# Altium schematic sheet H-BRIDGE.SchDoc
size D; SheetNumber: 2; SheetTotal: 2; PageSetup: Record=PageOptions|CenterHorizontal=True|CenterVertical=True|PrintScale=0.72|XCorrection=1.00|YCorrection=1.00|PrintKind=0|BorderSize=5000000|LeftOffset=0|BottomOffset=0|Orientation=2|PaperLength=1000|PaperWidth=1000|Scale=100|PaperSource=7|PrintQuality=-4|MediaType=1|DitherType=10|PaperKind=Letter (8 1/2 x 11 in)|PrintScaleMode=1
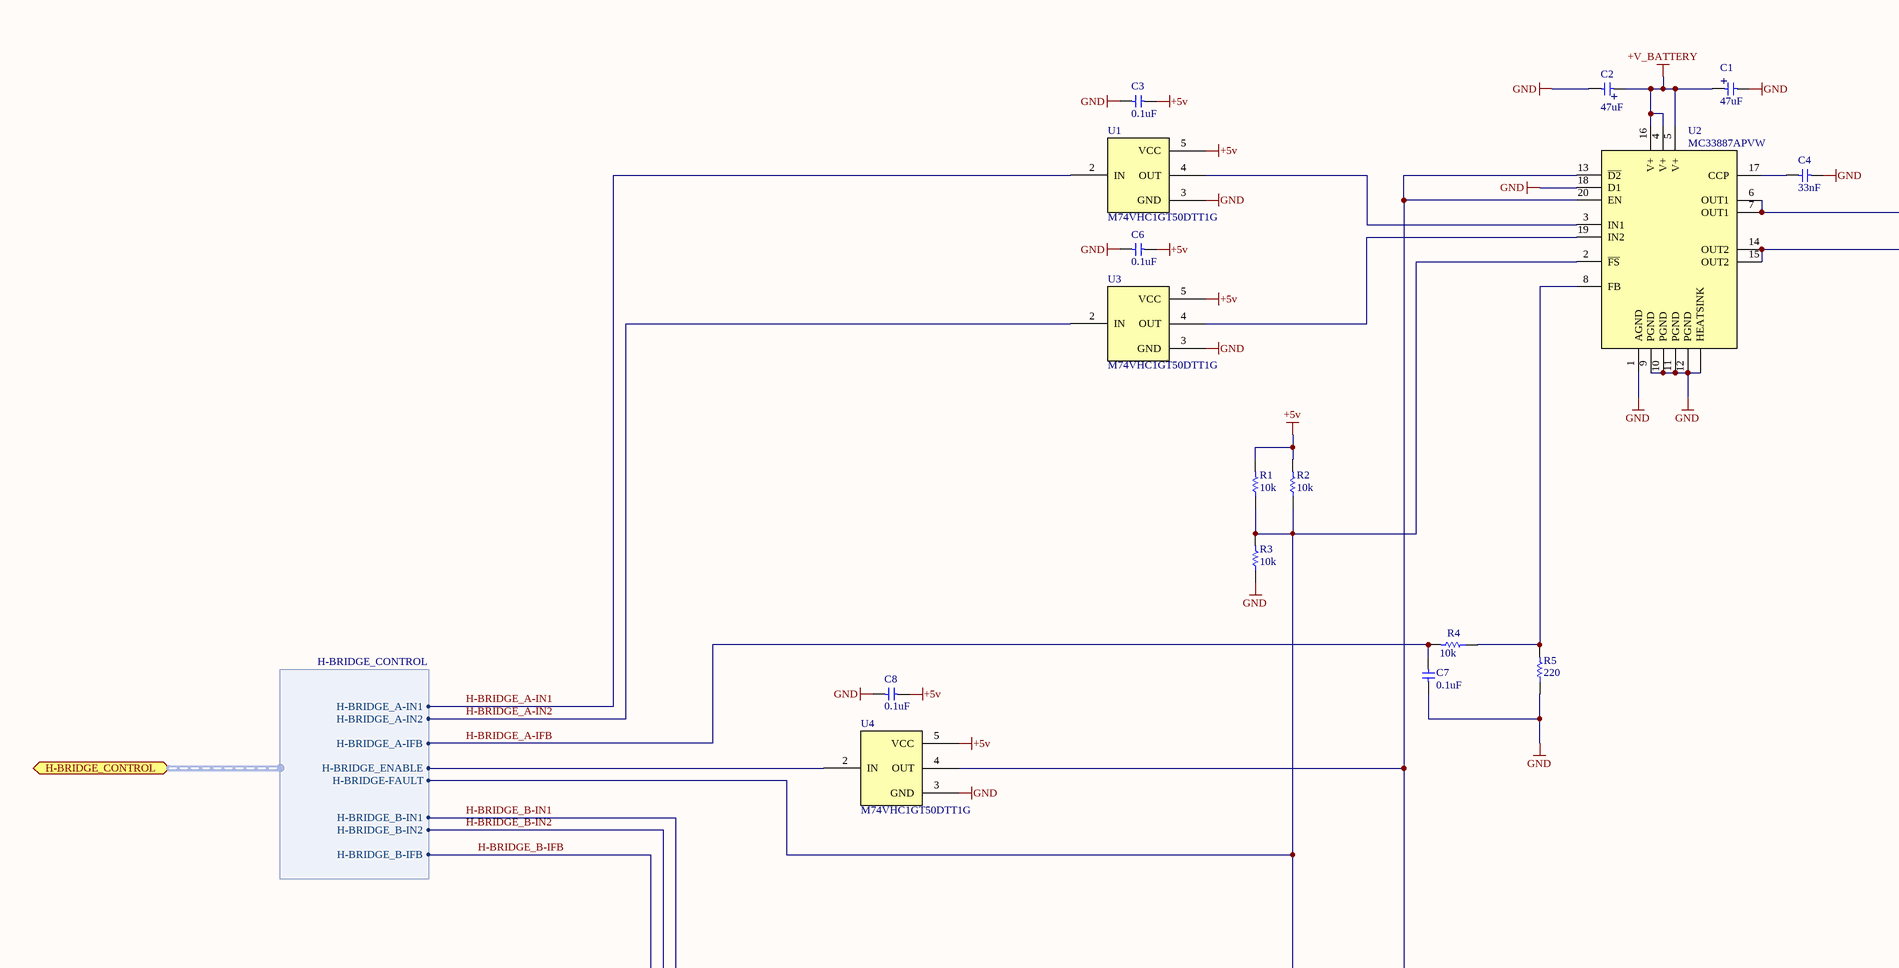
[diagram p0: H-BRIDGE.SchDoc, top left]
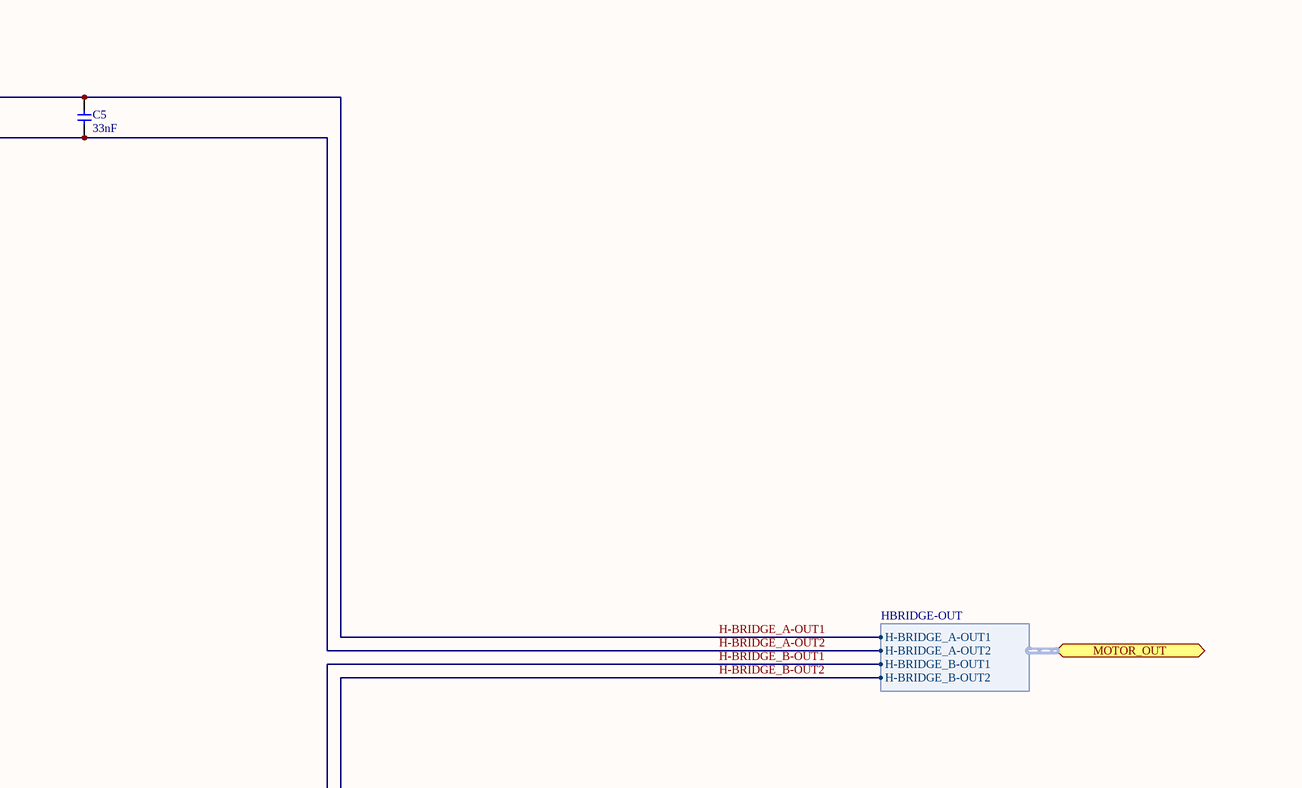
[diagram p1: H-BRIDGE.SchDoc, top right]
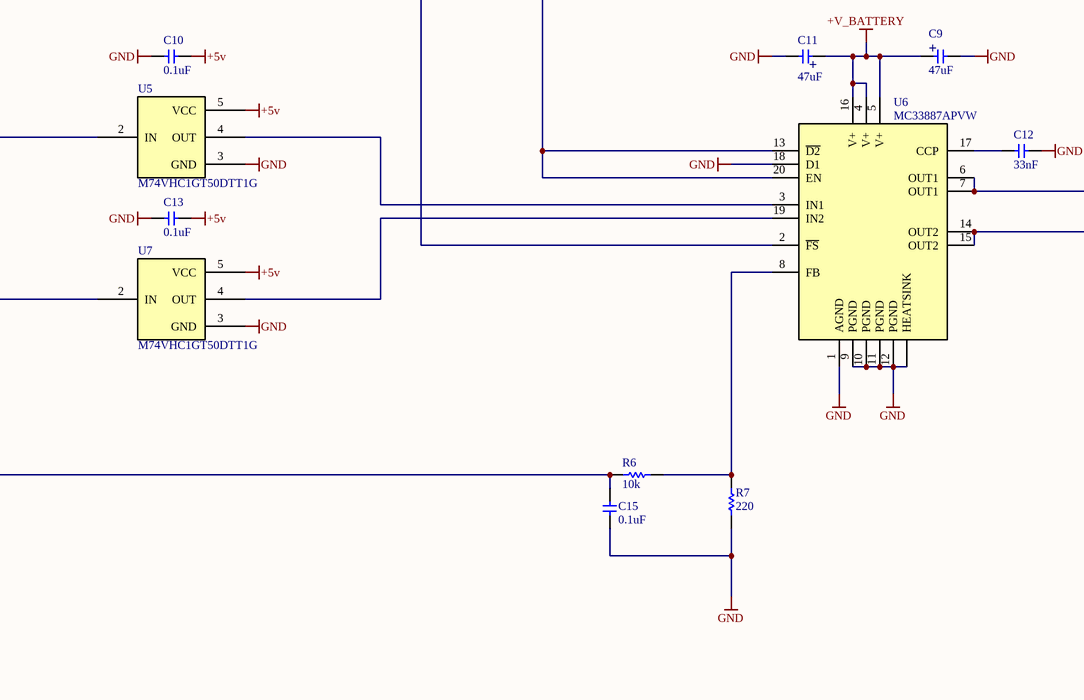
[diagram p2: H-BRIDGE.SchDoc, bottom left]
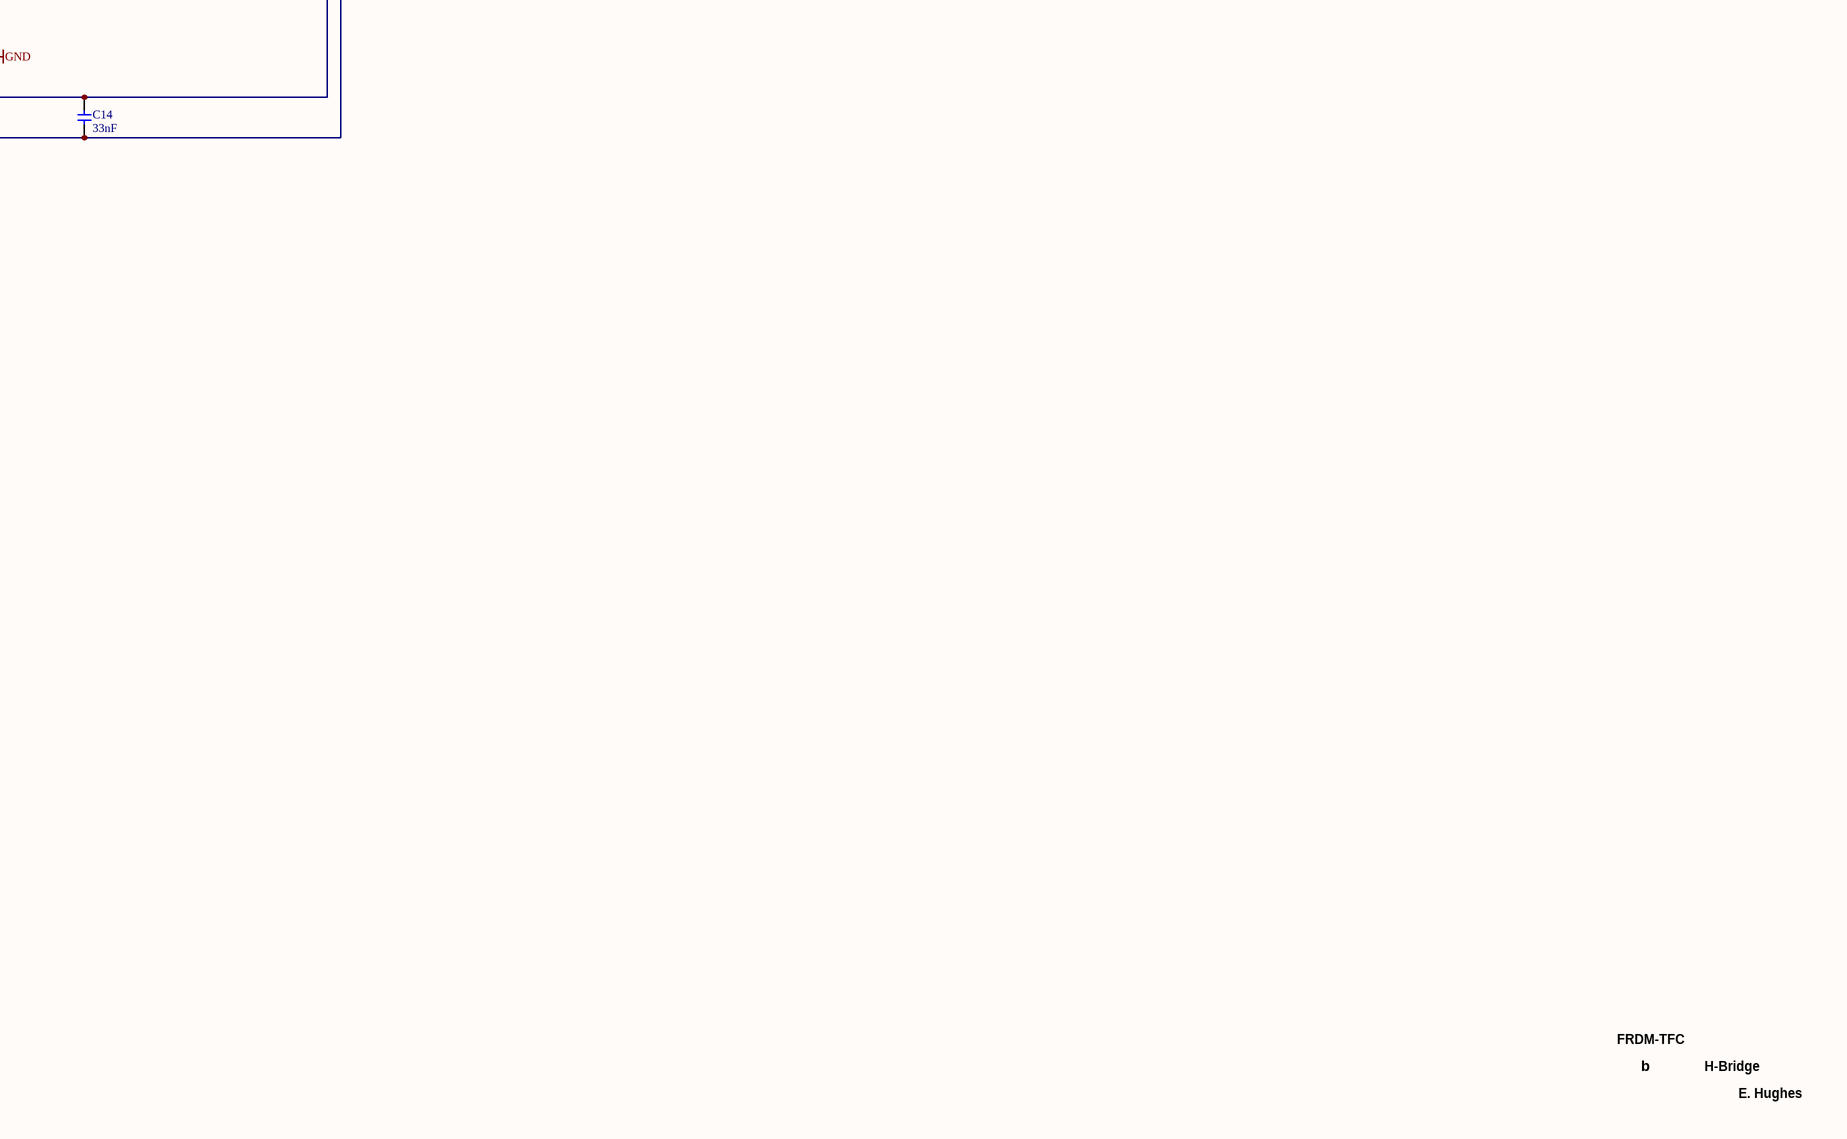
[diagram p3: H-BRIDGE.SchDoc, bottom right]

## Parts
C1  47uF  [PANASONIC_D]
C2  47uF  [PANASONIC_D]
C3  0.1uF  [C0603]
C4  33nF  [C0603]
C5  33nF  [C0603]
C6  0.1uF  [C0603]
C7  0.1uF  [C0603]
C8  0.1uF  [C0603]
C9  47uF  [PANASONIC_D]
C10  0.1uF  [C0603]
C11  47uF  [PANASONIC_D]
C12  33nF  [C0603]
C13  0.1uF  [C0603]
C14  33nF  [C0603]
C15  0.1uF  [C0603]
R1  10k  [R0603]
R2  10k  [R0603]
R3  10k  [R0603]
R4  10k  [R0603]
R5  220  [R0603]
R6  10k  [R0603]
R7  220  [R0603]
U1  M74VHC1GT50DTT1G  [SOT95P245X145-5L]
U2  MC33887APVW  [FREESCALE HSOP-20]
U3  M74VHC1GT50DTT1G  [SOT95P245X145-5L]
U4  M74VHC1GT50DTT1G  [SOT95P245X145-5L]
U5  M74VHC1GT50DTT1G  [SOT95P245X145-5L]
U6  MC33887APVW  [FREESCALE HSOP-20]
U7  M74VHC1GT50DTT1G  [SOT95P245X145-5L]

## Ports
H-BRIDGE_CONTROL (harness H-BRIDGE_CONTROL), MOTOR_OUT (harness HBRIDGE-OUT)

## Harnesses
H-BRIDGE_CONTROL: H-BRIDGE_A-IN2, H-BRIDGE_A-IN1, H-BRIDGE_ENABLE, H-BRIDGE-FAULT, H-BRIDGE_A-IFB, H-BRIDGE_B-IN2, H-BRIDGE_B-IN1, H-BRIDGE_B-IFB
HBRIDGE-OUT: H-BRIDGE_A-OUT1, H-BRIDGE_A-OUT2, H-BRIDGE_B-OUT1, H-BRIDGE_B-OUT2

## Nets
+5v: C3.2 C6.2 C8.2 C10.2 C13.2 R1.2 R2.2 U1.5(VCC) U3.5(VCC) U4.5(VCC) U5.5(VCC) U7.5(VCC)
+V_BATTERY: C1.1 C2.1 C9.1 C11.1 U2.4(V+) U2.5(V+) U2.16(V+) U6.4(V+) U6.5(V+) U6.16(V+)
GND: C1.2 C2.2 C3.1 C4.2 C6.1 C7.2 C8.1 C9.2 C10.1 C11.2 C12.2 C13.1 C15.2 R3.1 R5.1 R7.1 U1.3(GND) U2.1(AGND) U2.9(PGND) U2.10(PGND) U2.11(PGND) U2.12(PGND) U2.18(D1) U2.HEATSINK U3.3(GND) U4.3(GND) U5.3(GND) U6.1(AGND) U6.9(PGND) U6.10(PGND) U6.11(PGND) U6.12(PGND) U6.18(D1) U6.HEATSINK U7.3(GND)
H-BRIDGE_A-IFB: C7.1 R4.2 ; port H-BRIDGE_CONTROL.H-BRIDGE_A-IFB
H-BRIDGE_A-IN1: U1.2(IN) ; port H-BRIDGE_CONTROL.H-BRIDGE_A-IN1
H-BRIDGE_A-IN2: U3.2(IN) ; port H-BRIDGE_CONTROL.H-BRIDGE_A-IN2
H-BRIDGE_A-OUT1: C5.2 U2.6(OUT1) U2.7(OUT1) ; port MOTOR_OUT.H-BRIDGE_A-OUT1
H-BRIDGE_A-OUT2: C5.1 U2.14(OUT2) U2.15(OUT2) ; port MOTOR_OUT.H-BRIDGE_A-OUT2
H-BRIDGE_B-IFB: C15.1 R6.2 ; port H-BRIDGE_CONTROL.H-BRIDGE_B-IFB
H-BRIDGE_B-IN1: U5.2(IN) ; port H-BRIDGE_CONTROL.H-BRIDGE_B-IN1
H-BRIDGE_B-IN2: U7.2(IN) ; port H-BRIDGE_CONTROL.H-BRIDGE_B-IN2
H-BRIDGE_B-OUT1: C14.2 U6.6(OUT1) U6.7(OUT1) ; port MOTOR_OUT.H-BRIDGE_B-OUT1
H-BRIDGE_B-OUT2: C14.1 U6.14(OUT2) U6.15(OUT2) ; port MOTOR_OUT.H-BRIDGE_B-OUT2
NetC4_1: C4.1 U2.17(CCP)
NetC12_1: C12.1 U6.17(CCP)
NetR1_1: R1.1 R2.1 R3.2 U2.2(~{FS}) U6.2(~{FS}) ; port H-BRIDGE_CONTROL.H-BRIDGE-FAULT
NetR4_1: R4.1 R5.2 U2.8(FB)
NetR6_1: R6.1 R7.2 U6.8(FB)
NetU1_4: U1.4(OUT) U2.3(IN1)
NetU2_13: U2.13(~{D2}) U2.20(EN) U4.4(OUT) U6.13(~{D2}) U6.20(EN)
NetU2_19: U2.19(IN2) U3.4(OUT)
NetU4_2: U4.2(IN) ; port H-BRIDGE_CONTROL.H-BRIDGE_ENABLE
NetU5_4: U5.4(OUT) U6.3(IN1)
NetU6_19: U6.19(IN2) U7.4(OUT)

## Notes on the sheet
- FRDM-TFC
- b
- H-Bridge
- E. Hughes
- -1
- 2
- Wavenumber
- Technologies
- pl
- Rev:
- Sheet
- of
- (in symbol EEE-1EA470WP) +

## Library data of the parts
C1 C2 C9 C11 = EEE-1EA470WP: CAP ELECT 47UF 25V VS SMD; Manufacturer: Panasonic - ECG; Capacitance: 47µF; Tolerance: ±20%; Lifetime @ Temp.: 1000 Hrs @ 85°C; Ripple Current: 70mA; Surface Mount Land Size: 0.260" L x 0.260" W (6.60mm x 6.60mm); Value: 47uF; Supplier 1: Digi-Key; Manufacturer Part Number: EEE-1EA470WP; RoHS: RoHS Compliant; Category: Capacitors; Stock 1: 149543; Pricing 1: 1=0.56, 50=0.3204, 100=0.267, 250=0.20024, 500=0.17088 (USD); Voltage Rating: 25V; Operating Temperature: -40°C ~ 85°C; Features: General Purpose; ESR (Equivalent Series Resistance): -; Impedance: -; Mounting Type: Surface Mount; Package / Case: Radial, Can - SMD; Size / Dimension: 0.248" Dia (6.30mm); Height: 0.213" (5.40mm); Lead Spacing: -; Packaging: Cut Tape (CT); ComponentLink1URL: http://industrial.panasonic.com/www-cgi/jvcr13pz.cgi?E+PZ+3+ABA0002+EEE1EA470WP+7+WW; ComponentLink1Description: http://industrial.panasonic.com/www-cgi/jvcr13pz.cgi?E+PZ+3+ABA0002+EEE1EA470WP+7+WW; Supplier Part Number 1: PCE3908CT-ND
C3 C6-C8 C10 C13 C15 = GRM188R71H104KA93D: CAP CER .1UF 50V 10% X7R 0603; Manufacturer: Murata Electronics North America; Capacitance: 0.1µF; Manufacturer Part Number: GRM188R71H104KA93D; Value: CAP CER .1UF 50V 10% X7R 0603; Supplier 1: Digi-Key; Supplier Part Number 1: 490-1519-1-ND; RoHS: RoHS Compliant; Category: Capacitors; Stock 1: 9370695; Pricing 1: 10=0.037, 100=0.0221, 500=0.01276, 1000=0.00884 (USD); Voltage - Rated: 50V; Tolerance: ±10%; Temperature Coefficient: X7R; Mounting Type: Surface Mount, MLCC; Operating Temperature: -55°C ~ 125°C; Features: -; Applications: General Purpose; Ratings: -; Package / Case: 0603 (1608 Metric); Size / Dimension: 0.063" L x 0.031" W (1.60mm x 0.80mm); Lead Spacing: -; Thickness: 0.80mm; Packaging: Cut Tape (CT); Lead Style: -; ComponentLink1URL: http://search.murata.co.jp/Ceramy/image/img/PDF/ENG/GRM188R71H104KA93.pdf; ComponentLink1Description: http://search.murata.co.jp/Ceramy/image/img/PDF/ENG/GRM188R71H104KA93.pdf
C4 C5 C12 C14 = GRM188R71H333KA61D: CAP CER 0.033UF 50V 10% X7R 0603; Manufacturer: Murata Electronics North America; Capacitance: 0.033µF; Supplier 1: Digi-Key; Supplier Part Number 1: 490-3286-1-ND; Manufacturer Part Number: GRM188R71H333KA61D; RoHS: RoHS Compliant; Category: Capacitors; Stock 1: 272751; Pricing 1: 10=0.08, 50=0.0636, 100=0.0477, 250=0.03444, 500=0.02544, 1000=0.01723 (USD); Voltage - Rated: 50V; Tolerance: ±10%; Temperature Coefficient: X7R; Mounting Type: Surface Mount, MLCC; Operating Temperature: -55°C ~ 125°C; Applications: General Purpose; Ratings: -; Package / Case: 0603 (1608 Metric); Size / Dimension: 0.063" L x 0.031" W (1.60mm x 0.80mm); Height - Seated (Max): -; Thickness (Max): 0.035" (0.90mm); Lead Spacing: -; Features: -; Packaging: Cut Tape (CT); Lead Style: -; ComponentLink1URL: http://search.murata.co.jp/Ceramy/image/img/PDF/ENG/GRM188R71H333KA61.pdf; ComponentLink1Description: http://search.murata.co.jp/Ceramy/image/img/PDF/ENG/GRM188R71H333KA61.pdf; Value: 33nF
R1-R4 R6 = ERJ-3EKF1002V: RES 10.0K OHM 1/10W 1% 0603 SMD; Source Part Number: P10.0KHCT-ND; Manufacturer: Panasonic - ECG; Power (Watts): 0.1W, 1/10W; Temperature Coefficient: ±100ppm/°C; Source: Digikey; ROHS Certificate: *; RoHS: RoHS Compliant; Category: Resistors; Resistance In Ohms: 10.0K; Composition: Thick Film; Features: -; Tolerance: ±1%; Case: 0603 (1608 metric); Size / Dimension: 0.063" L x 0.031" W (1.60mm x 0.80mm); Height: 0.018" (0.45mm); Lead Style: Surface Mount (SMD - SMT); Packaging: Cut Tape (CT); ComponentLink1URL: http://industrial.panasonic.com/www-cgi/jvcr13pz.cgi?E+PZ+3+AOA0002+ERJ3EKF1002V+7+WW; ComponentLink1Description: http://industrial.panasonic.com/www-cgi/jvcr13pz.cgi?E+PZ+3+AOA0002+ERJ3EKF1002V+7+WW; Manufacturer Part Number: ERJ-3EKF1002V; Supplier 1: Digi-Key; Stock 1: 10570746; Pricing 1: 1=0.04, 50=0.015, 100=0.0114, 250=0.00844, 500=0.00624, 1000=0.00416 (USD); Supplier Part Number 1: P10.0KHCT-ND; Value: 10k
R5 R7 = ERJ-3EKF2200V: RES 220 OHM 1/10W 1% 0603 SMD; Manufacturer: Panasonic - ECG; Power (Watts): 0.1W, 1/10W; Temperature Coefficient: ±100ppm/°C; Supplier 1: Digi-Key; Supplier Part Number 1: P220HCT-ND; Manufacturer Part Number: ERJ-3EKF2200V; RoHS: RoHS Compliant; Category: Resistors; Stock 1: 365530; Pricing 1: 1=0.04, 50=0.0138, 100=0.0105, 250=0.0078, 500=0.00576, 1000=0.00384 (USD); Resistance (Ohms): 220; Composition: Thick Film; Features: -; Tolerance: ±1%; Size / Dimension: 0.063" L x 0.031" W (1.60mm x 0.80mm); Height: 0.022" (0.55mm); Number of Terminations: 2; Packaging: Cut Tape (CT); Package / Case: 0603 (1608 Metric); ComponentLink1URL: http://industrial.panasonic.com/www-cgi/jvcr13pz.cgi?E+PZ+3+AOA0002+ERJ3EKF2200V+7+WW; ComponentLink1Description: http://industrial.panasonic.com/www-cgi/jvcr13pz.cgi?E+PZ+3+AOA0002+ERJ3EKF2200V+7+WW; Value: 220
U1 U3-U5 U7 = M74VHC1GT50DTT1G: IC BUFF CMOS LVL/SFTR N-I SOT235; Manufacturer: ON Semiconductor; Logic Type: Buffer/Line Driver, Non-Inverting; Number of Elements: 1; Current - Output High, Low: 8mA, 8mA; Voltage - Supply: 1.65 V ~ 5.5 V; Supplier 1: Digi-Key; Supplier Part Number 1: M74VHC1GT50DTT1GOSCT-ND; Manufacturer Part Number: M74VHC1GT50DTT1G; RoHS: RoHS Compliant; Category: Integrated Circuits (ICs); Stock 1: 28989; Pricing 1: 1=0.44, 25=0.2456, 100=0.1866, 250=0.13216, 500=0.10574, 1000=0.08086 (USD); Number of Bits per Element: 1; Operating Temperature: -55°C ~ 125°C; Mounting Type: Surface Mount; Package / Case: SOT-23-5 Thin, TSOT-23-5; Supplier Device Package: SOT-23-5; Packaging: Cut Tape (CT); ComponentLink1URL: http://www.onsemi.com/pub_link/Collateral/MC74VHC1GT50-D.PDF; ComponentLink1Description: http://www.onsemi.com/pub_link/Collateral/MC74VHC1GT50-D.PDF; Value: M74VHC1GT50DTT1G
U2 U6 = MC33887APVW: Motor / Motion / Ignition Controllers & Drivers H-BRIDGE W/LD CURNT FDBK; Manufacturer: Freescale Semiconductor; Supply Current: 5 A; Supply Voltage (Min): 5 V; Operating Supply Voltage: 28 V; Product Status: New at Mouser; Supplier 1: Mouser; Supplier Part Number 1: 841-MC33887APVW; Manufacturer Part Number: MC33887APVW; RoHS: RoHS Compliant By Exemption; Category: Motor / Motion / Ignition Controllers & Drivers; Stock 1: 4800; Pricing 1: 1=7.71, 25=6.59, 50=5.89, 100=5.62, 500=5.21 (AUD); Package / Case: HSOP-20; Packaging: Tube; Product: Brushed DC Motor Drivers; Type: H-Bridge; Mounting Style: SMD/SMT; RoHS - Mouser: E; Minimum Order Quantity: 1; Reeling: False; ComponentLink1URL: http://cache.freescale.com/files/analog/doc/data_sheet/MC33887.pdf; ComponentLink1Description: http://cache.freescale.com/files/analog/doc/data_sheet/MC33887.pdf; Value: MC33887APVW